# Altium schematic sheet csi_cam.SchDoc: MIPI CSI camera interface
size A3; Author: Olexandr Gudozhnik; Organization: EPFL-STI-LIS; Address1: EPFL, Station 9; Address2: 1015, Lausanne; Address3: Switzerland; DocumentNumber: 8; SheetNumber: 8; SheetTotal: 8
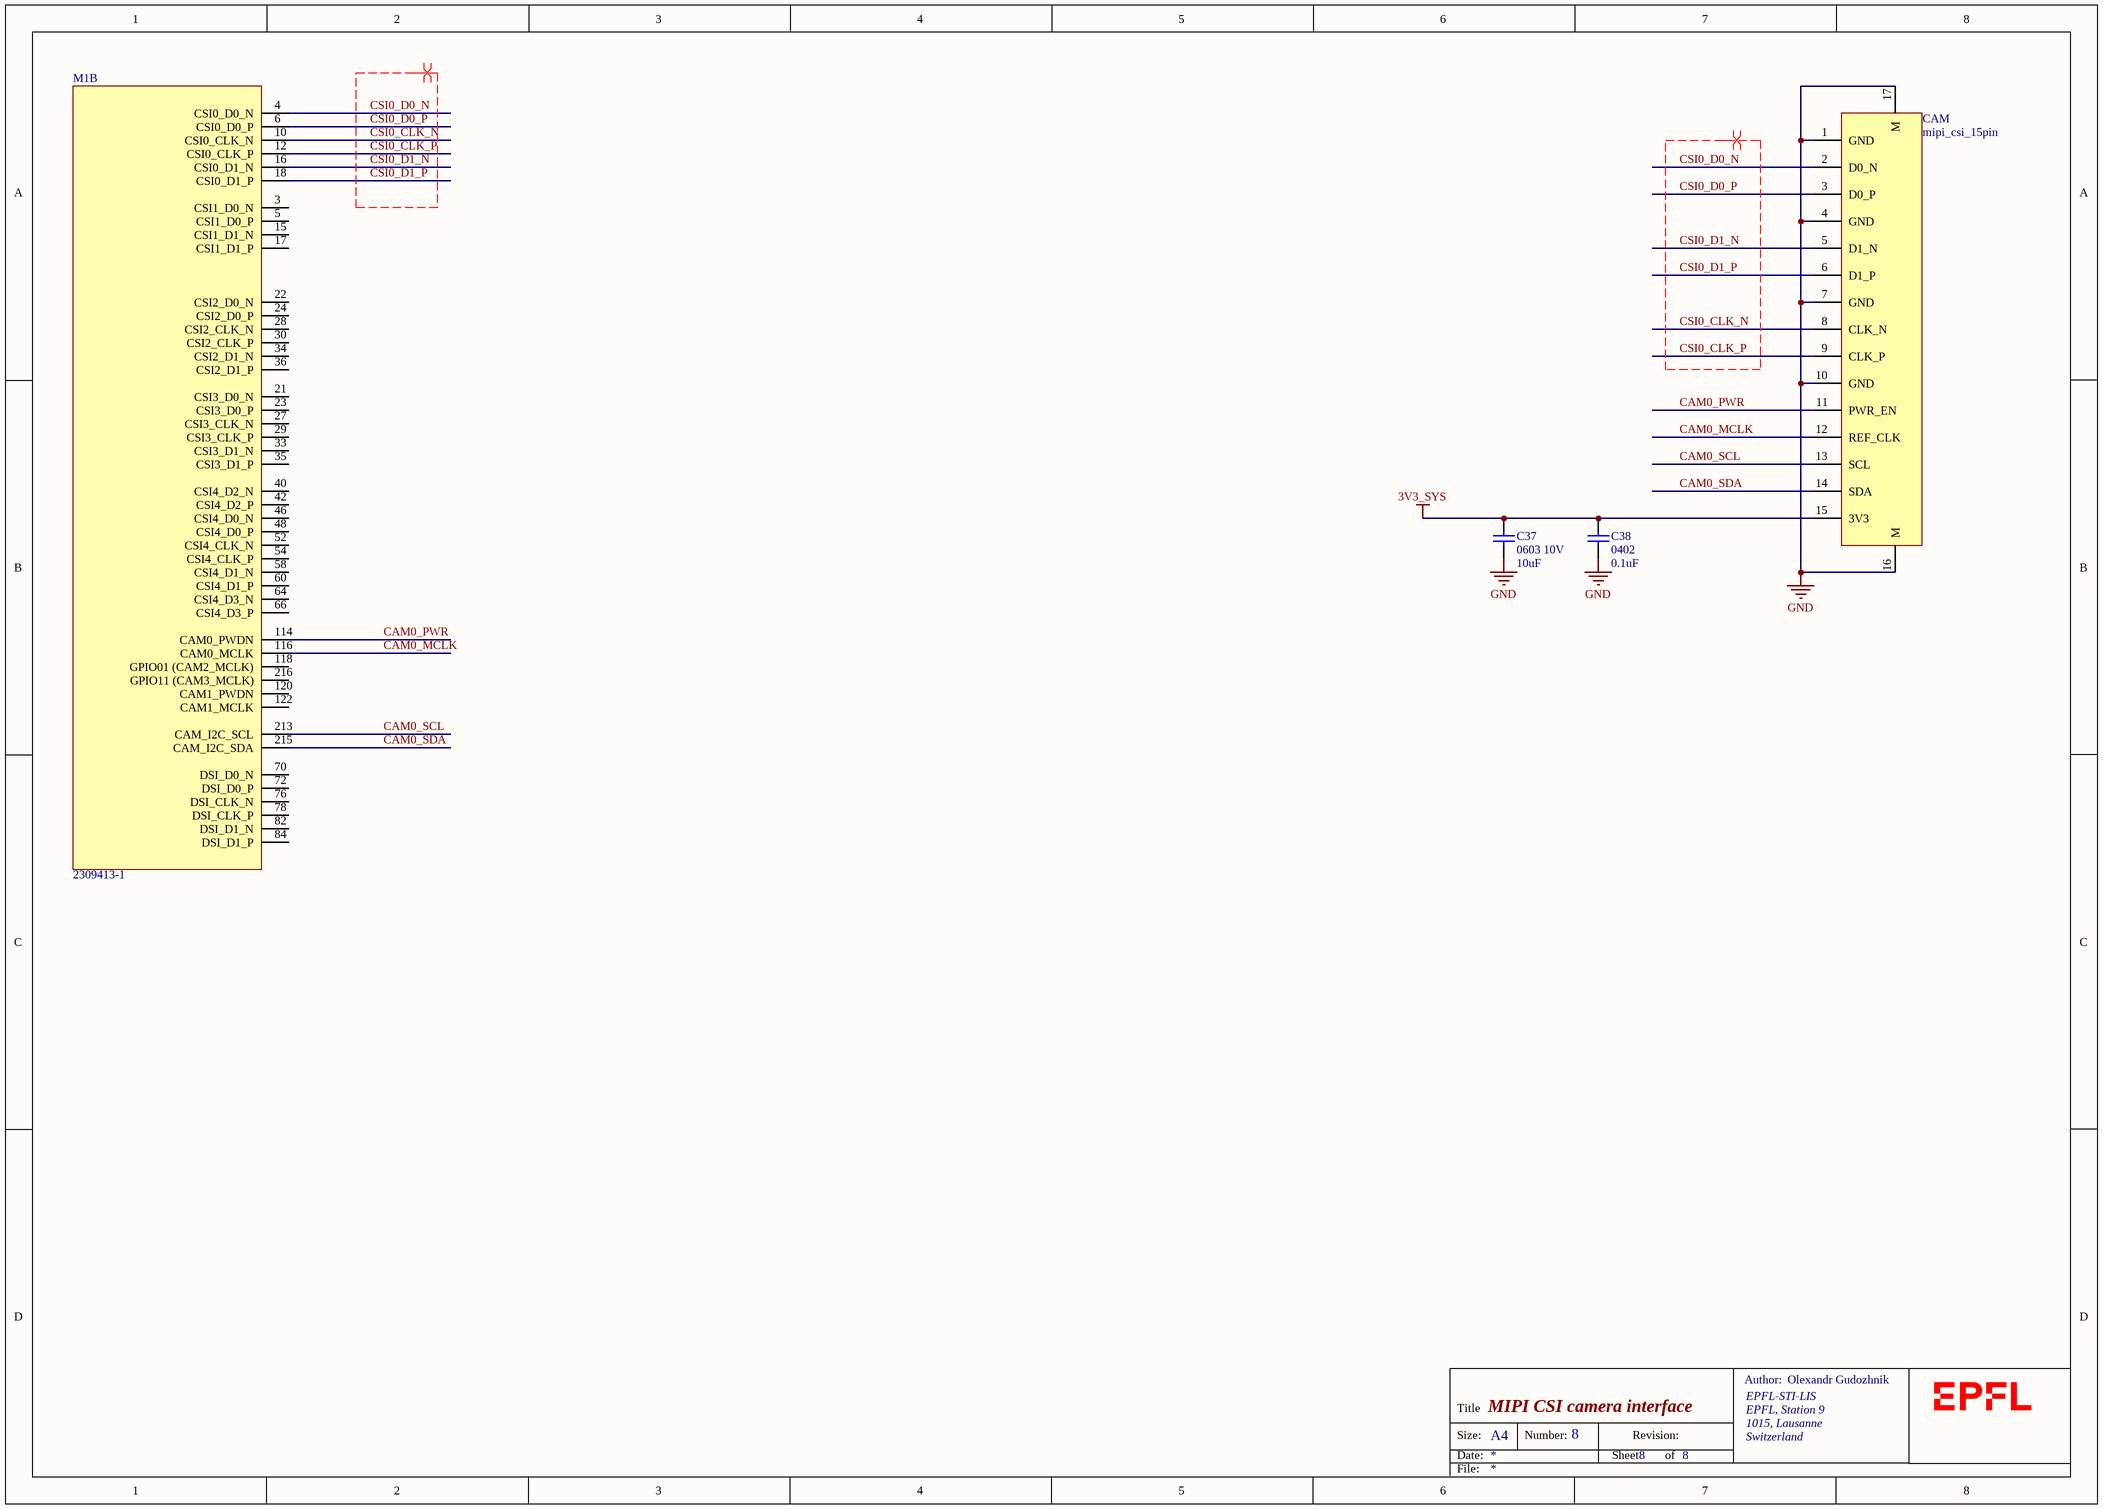
[diagram p0: csi_cam.SchDoc]

## Parts
C37  0603 10V  value 10uF  [cap0603]
C38  0402  value 0.1uF  [cap0402]
CAM  mipi_csi_15pin  [molex_52271_15pin]
M1  2309413-1  [jetson-nano-connector]  (part B of 7)

## Nets
3V3_SYS: C37.2 C38.1 CAM.15(3V3)
GND: C37.1 C38.2 CAM.1(GND) CAM.4(GND) CAM.7(GND) CAM.10(GND) CAM.16(M) CAM.17(M)
CAM0_MCLK: CAM.12(REF_CLK) M1.116(CAM0_MCLK)
CAM0_PWR: CAM.11(PWR_EN) M1.114(CAM0_PWDN)
CAM0_SCL: CAM.13(SCL) M1.213(CAM_I2C_SCL)
CAM0_SDA: CAM.14(SDA) M1.215(CAM_I2C_SDA)
CSI0_CLK_N: CAM.8(CLK_N) M1.10(CSI0_CLK_N)
CSI0_CLK_P: CAM.9(CLK_P) M1.12(CSI0_CLK_P)
CSI0_D0_N: CAM.2(D0_N) M1.4(CSI0_D0_N)
CSI0_D0_P: CAM.3(D0_P) M1.6(CSI0_D0_P)
CSI0_D1_N: CAM.5(D1_N) M1.16(CSI0_D1_N)
CSI0_D1_P: CAM.6(D1_P) M1.18(CSI0_D1_P)

Not connected (* = marked no-connect by the designer): M1 3(CSI1_D0_N) 5(CSI1_D0_P) 15(CSI1_D1_N) 17(CSI1_D1_P) 21(CSI3_D0_N) 22(CSI2_D0_N) 23(CSI3_D0_P) 24(CSI2_D0_P) 27(CSI3_CLK_N) 28(CSI2_CLK_N) 29(CSI3_CLK_P) 30(CSI2_CLK_P) 33(CSI3_D1_N) 34(CSI2_D1_N) 35(CSI3_D1_P) 36(CSI2_D1_P) 40(CSI4_D2_N) 42(CSI4_D2_P) 46(CSI4_D0_N) 48(CSI4_D0_P) 52(CSI4_CLK_N) 54(CSI4_CLK_P) 58(CSI4_D1_N) 60(CSI4_D1_P) 64(CSI4_D3_N) 66(CSI4_D3_P) 70(DSI_D0_N) 72(DSI_D0_P) 76(DSI_CLK_N) 78(DSI_CLK_P) 82(DSI_D1_N) 84(DSI_D1_P) 118(GPIO01_(CAM2_MCLK)) 120(CAM1_PWDN) 122(CAM1_MCLK) 216(GPIO11_(CAM3_MCLK))

## Layout directives
differential pair; differential pair class DIFF95; differential pair class CSI: CSI0_CLK_N, CSI0_CLK_P, CSI0_D0_N, CSI0_D0_P, CSI0_D1_N, CSI0_D1_P

## Notes on the sheet
- Author:
- Title
- Size:
- Date:
- A4
- Number:
- Sheet
- Revision:
- of
- File:

## Library data of the parts
C37 C38 = cap: standard, non-polarized capacitor; Supplier 1: Digi-Key; Footprint verified: no
  C37: Supplier Part Number 1: 490-10474-1-ND; Supplier Price 1: 0.23
  C38: Supplier Part Number 1: 490-14603-1-ND; Supplier Price 1: 0.08
CAM = mipi_csi_15pin: 15 pin FPC connector; Supplier 1: Digi-Key; Supplier Part Number 1: WM10967CT-ND
M1 = 2309413-1: Memory Socket, DDR4, SODIMM Socket, 260 Contacts, Copper Alloy, Gold Plated Contacts; Manufacturer: TE CONNECTIVITY; PartNumber: 2309413-1; Value: 2309413-1; PartSymbol: 2309413-1